# EAGLE design rpi-pwrbtn (EAGLE 6.5.0)
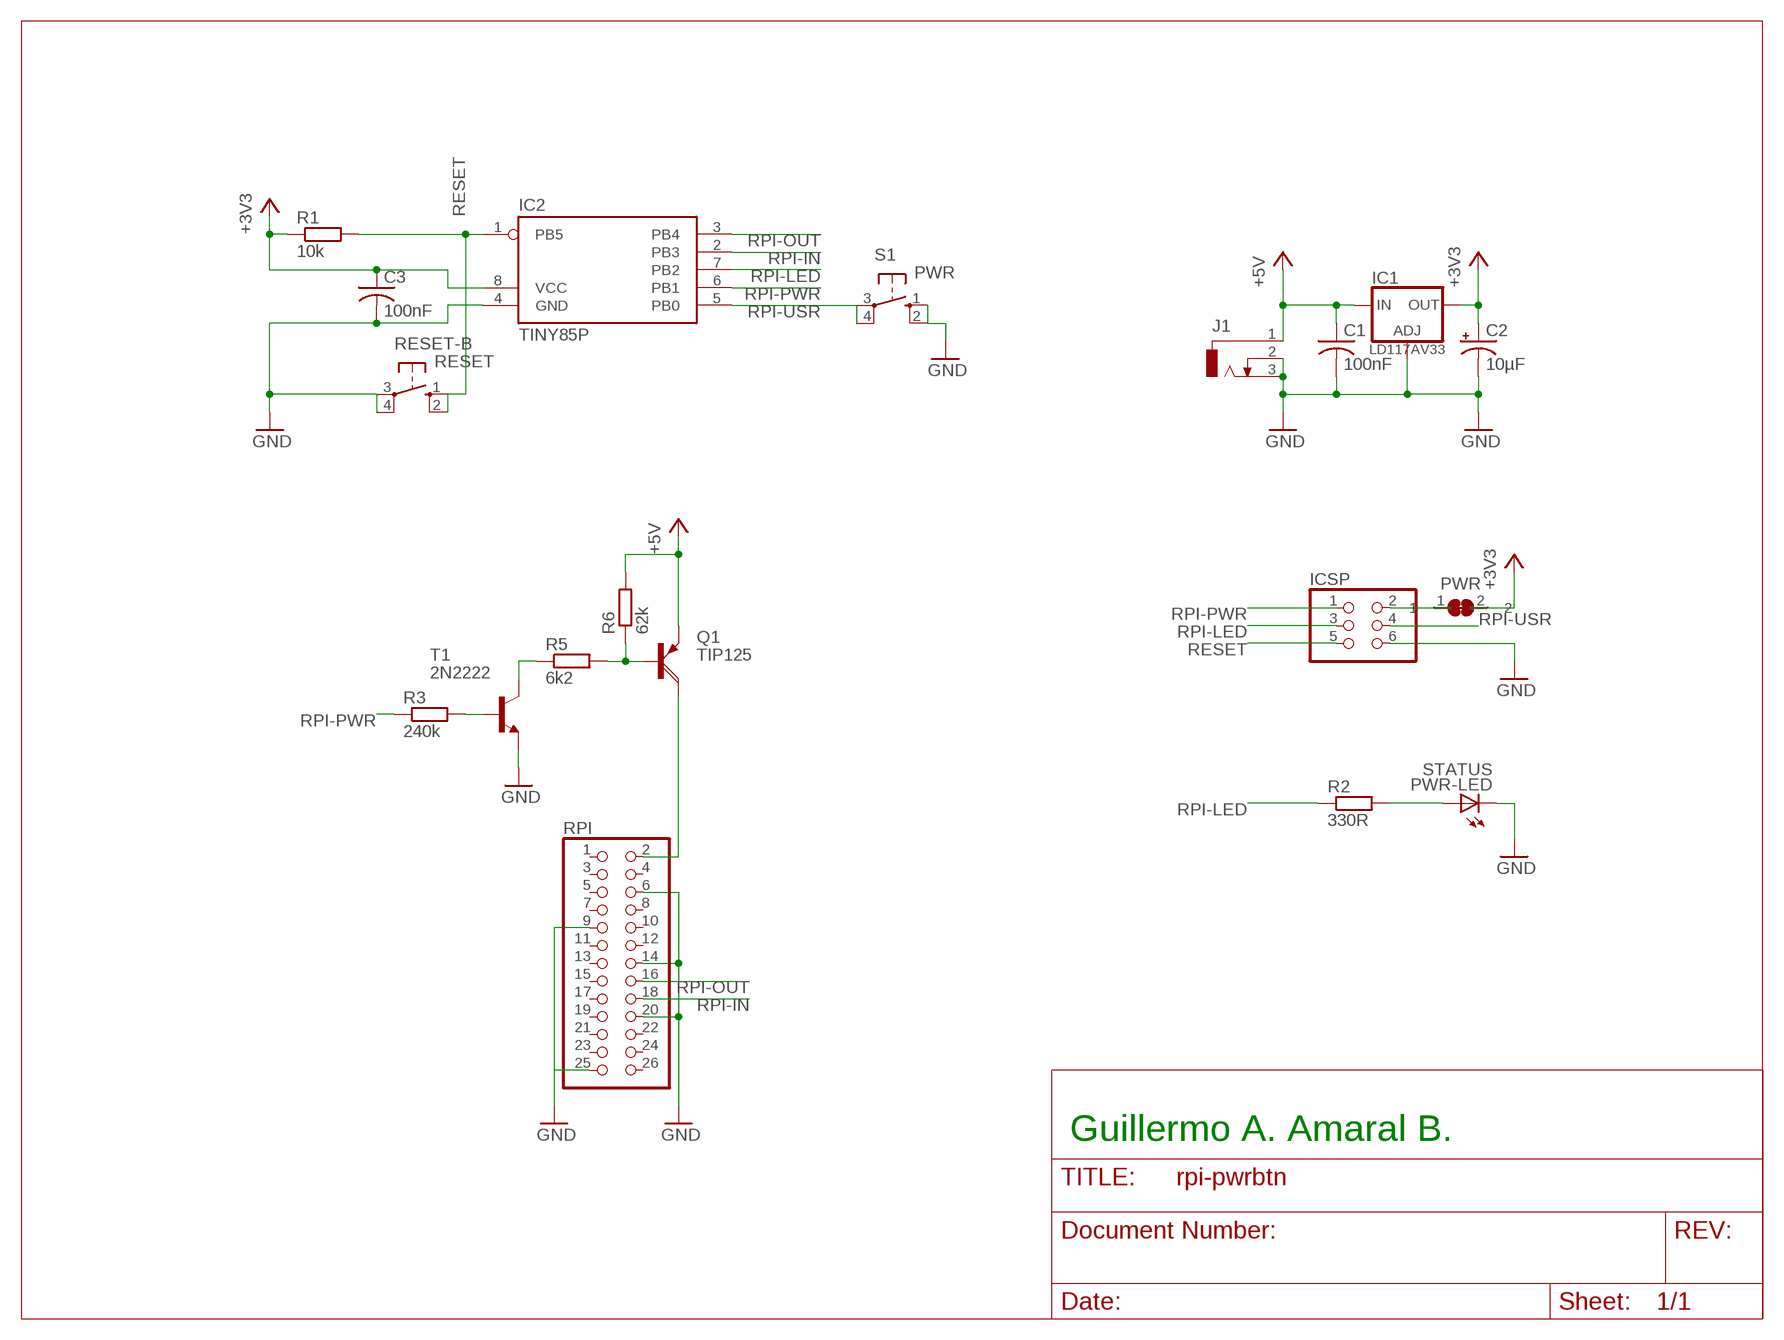
[diagram p0: schematic, sheet 1]

## Parts
C1  100nF  C-US050-024X044  [C050-024X044]
C2  10µF  CPOL-USE2,5-6E  [E2,5-6E]
C3  100nF  C-US050-024X044  [C050-024X044]
IC1  LD117AV33  [TO220L1]
IC2  TINY85P  [DIL08]
ICSP  PINHD-2X3  [2X03]
J1  DCJ0303  [DCJ0303]
PWR  SJ-BRIDGED  [SJ-BRIDGED]
PWR-LED  STATUS  LED5MM  [LED5MM]
Q1  TIP125  [TO220AH]
R1  10k  R-EU_0204/7  [0204/7]
R2  330R  R-EU_0204/7  [0204/7]
R3  240k  R-EU_0204/7  [0204/7]
R5  6k2  R-EU_0204/7  [0204/7]
R6  62k  R-EU_0204/7  [0204/7]
RESET-B  RESET  10-XX  [B3F-10XX]
RPI  PINHD-2X13  [2X13]
S1  PWR  10-XX  [B3F-10XX]
T1  2N2222  [TO18]

## Nets
+3V3: C2.+ C3.1 IC1.2(OUT) IC2.8(VCC) PWR.2 R1.1
+5V: C1.1 IC1.3(IN) J1.1 Q1.E R6.2
GND: C1.2 C2.- C3.2 IC1.1(ADJ) IC2.4(GND) ICSP.6 J1.2 J1.3 PWR-LED.K(C) RESET-B.3(P) RESET-B.4(P1) RPI.6 RPI.9 RPI.14 RPI.20 RPI.25 S1.1(S) S1.2(S1) T1.1(E)
ICSP-VCC: ICSP.2 PWR.1
N$1: PWR-LED.A R2.2
N$3: Q1.C RPI.2
N$4: Q1.B R5.2 R6.1
N$5: R3.2 T1.2(B)
N$6: R5.1 T1.3(C)
RESET: IC2.1(PB5) ICSP.5 R1.2 RESET-B.1(S) RESET-B.2(S1)
RPI-IN: IC2.2(PB3) RPI.18
RPI-LED: IC2.7(PB2) ICSP.3 R2.1
RPI-OUT: IC2.3(PB4) RPI.16
RPI-PWR: IC2.6(PB1) ICSP.1 R3.1
RPI-USR: IC2.5(PB0) ICSP.4 S1.3(P) S1.4(P1)
Unconnected: RPI.1 RPI.3 RPI.4 RPI.5 RPI.7 RPI.8 RPI.10 RPI.11 RPI.12 RPI.13 RPI.15 RPI.17 RPI.19 RPI.21 RPI.22 RPI.23 RPI.24 RPI.26

## Notes on the sheet
- Guillermo A. Amaral B.

## Library data of the parts
C1 C3 = resistor:C-US: CAPACITOR, American symbol
C2 = resistor:CPOL-US: POLARIZED CAPACITOR, American symbol
IC1 = v-reg:LD117A?*: Low drop fixed and adjustable positive voltage regulators 1 A Source: http://www.st.com/stonline/products/literature/ds/7194/ld1117axx.pdf
IC2 = gamaral:TINY85: AVR ATtiny85 MICROCONTROLLER 8K ISPF 256 bytes SRAM 512 bytes EEPROM
ICSP = pinhead:PINHD-2X3: PIN HEADER
J1 = con-jack:DCJ0303: DC POWER JACK Source: DCJ0303.pdf; OC_FARNELL: unknown; OC_NEWARK: unknown
PWR = gamaral:SJ-BRIDGED: Solder Jumper - Bridged
PWR-LED = led:LED: LED OSRAM: - CHIPLED LG R971, LG N971, LY N971, LG Q971, LY Q971, LO R971, LY R971 LH N974, LH R974 LS Q976, LO Q976, LY Q976 LO Q996 - Hyper CHIPLED LW Q18S LB Q993, LB Q99A, LB R99A - SideLED LS A670, LO A670, LY A670, LG A670, LP A670 LB A673, LV A673, LT A673, LW A673 LH A674 LY A675 LS A676, LA A676, LO A676, LY A676, LW A676 LS A679, LY A679, LG A679 - Hyper Micro SIDELED® LS Y876, LA Y876, LO Y876, LY Y876 LT Y87S - SmartLED LW L88C, LW L88S LB L89C, LB L89S, LG L890 LS L89K, LO L89K, LY L89K LS L896, LA L896, LO L896, LY L896 - TOPLED LS T670, LO T670, LY T670, LG T670, LP T670 LSG T670, LSP T670, LSY T670, LOP T670, LYG T670 LG T671, LOG T671, LSG T671 LB T673, LV T673, LT T673, LW T673 LH T674 LS T676, LA T676, LO T676, LY T676, LB T676, LH T676, LSB T676, LW T676 LB T67C, LV T67C, LT T67C, LS T67K, LO T67K, LY T67K, LW E67C LS E67B, LA E67B, LO E67B, LY E67B, LB E67C, LV E67C, LT E67C LW T67C LS T679, LY T679, LG T679 LS T770, LO T770, LY T770, LG T770, LP T770 LB T773, LV T773, LT T773, LW T773 LH T774 LS E675, LA E675, LY E675, LS T675 LS T776, LA T776, LO T776, LY T776, LB T776 LHGB T686 LT T68C, LB T68C - Hyper Mini TOPLED® LB M676 - Mini TOPLED Santana® LG M470 LS M47K, LO M47K, LY M47K Source: http://www.osram.convergy.de LUXEON: - LUMILED® LXK2-PW12-R00, LXK2-PW12-S00, LXK2-PW14-U00, LXK2-PW14-V00 LXK2-PM12-R00, LXK2-PM12-S00, LXK2-PM14-U00 LXK2-PE12-Q00, LXK2-PE12-R00, LXK2-PE12-S00, LXK2-PE14-T00, LXK2-PE14-U00 LXK2-PB12-K00, LXK2-PB12-L00, LXK2-PB12-M00, LXK2-PB14-N00, LXK2-PB14-P00, LXK2-PB14-Q00 LXK2-PR12-L00, LXK2-PR12-M00, LXK2-PR14-Q00, LXK2-PR14-R00 LXK2-PD12-Q00, LXK2-PD12-R00, LXK2-PD12-S00 LXK2-PH12-R00, LXK2-PH12-S00 LXK2-PL12-P00, LXK2-PL12-Q00, LXK2-PL12-R00 Source: www.luxeon.com KINGBRIGHT: KA-3528ASYC Source: www.kingbright.com
Q1 = transistor-power:TIP125: PNP DARLINGTON TRANSISTOR
R1-R3 R5 R6 = resistor:R-EU_: RESISTOR, European symbol
RESET-B S1 = switch-omron:10-XX: OMRON SWITCH; MPN: B3F-1000; OC_FARNELL: 176432; OC_NEWARK: 36M3542
RPI = pinhead:PINHD-2X13: PIN HEADER
T1 = transistor:2N2222: NPN TRANSISTOR

## Board
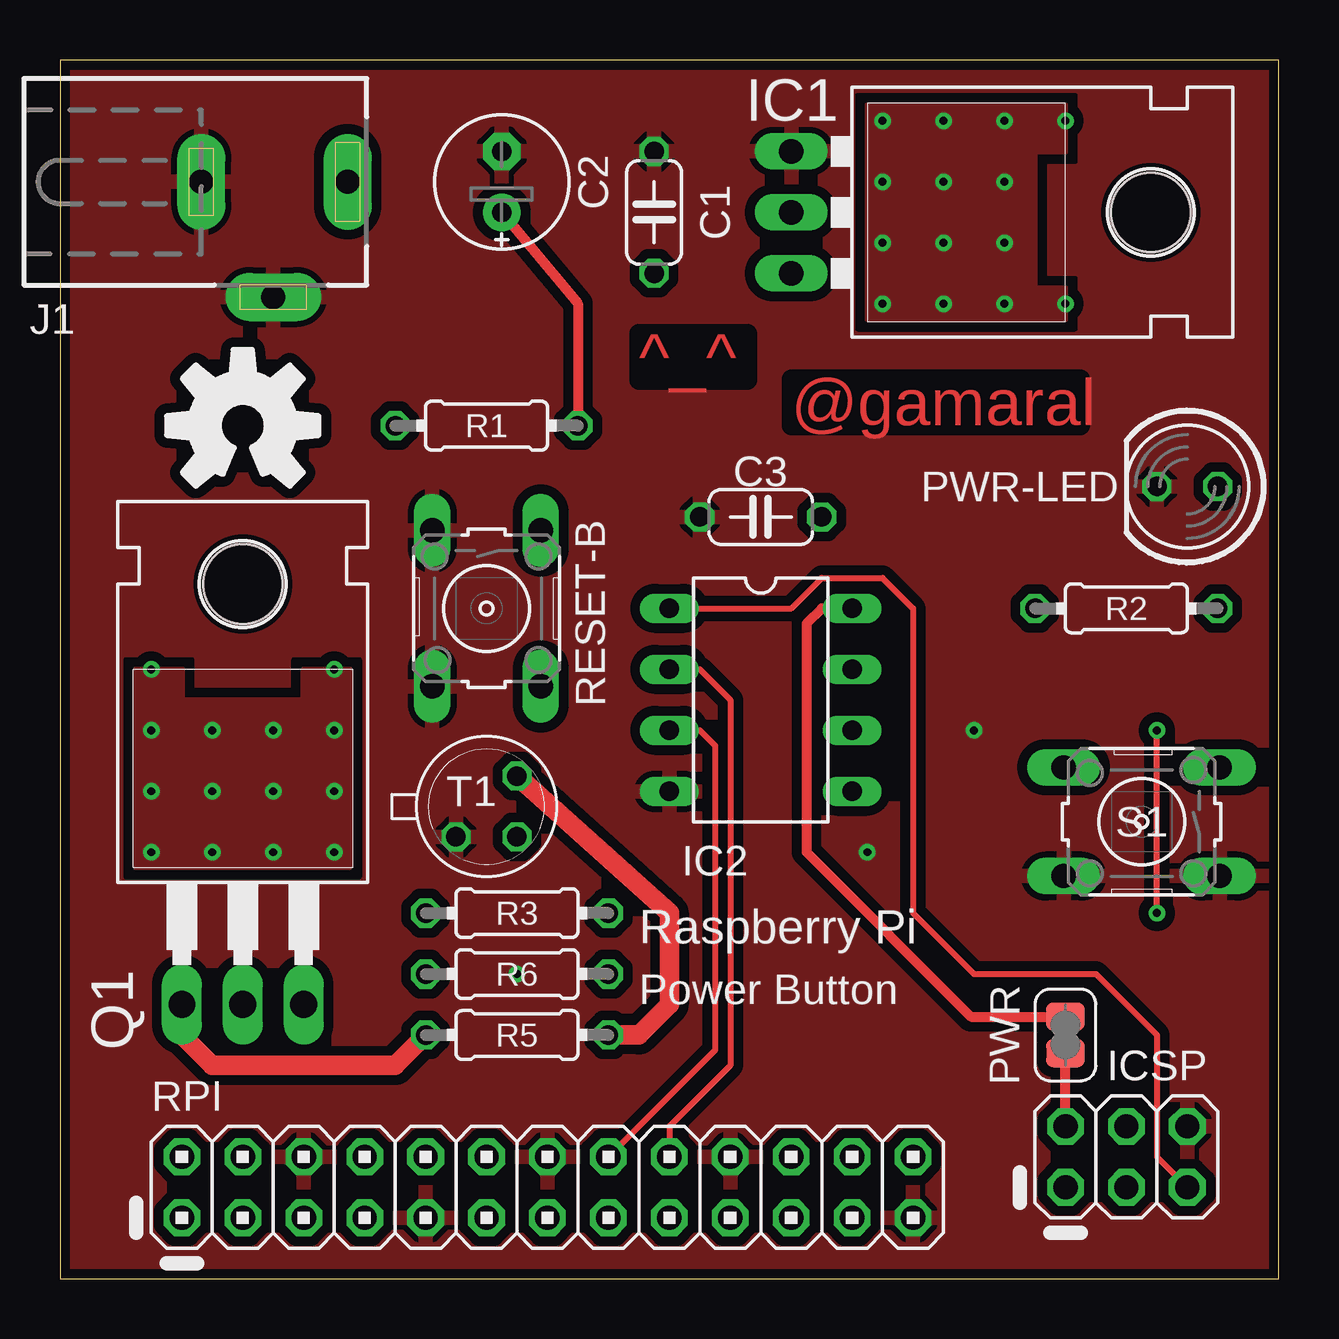
[diagram p1: board, top side]
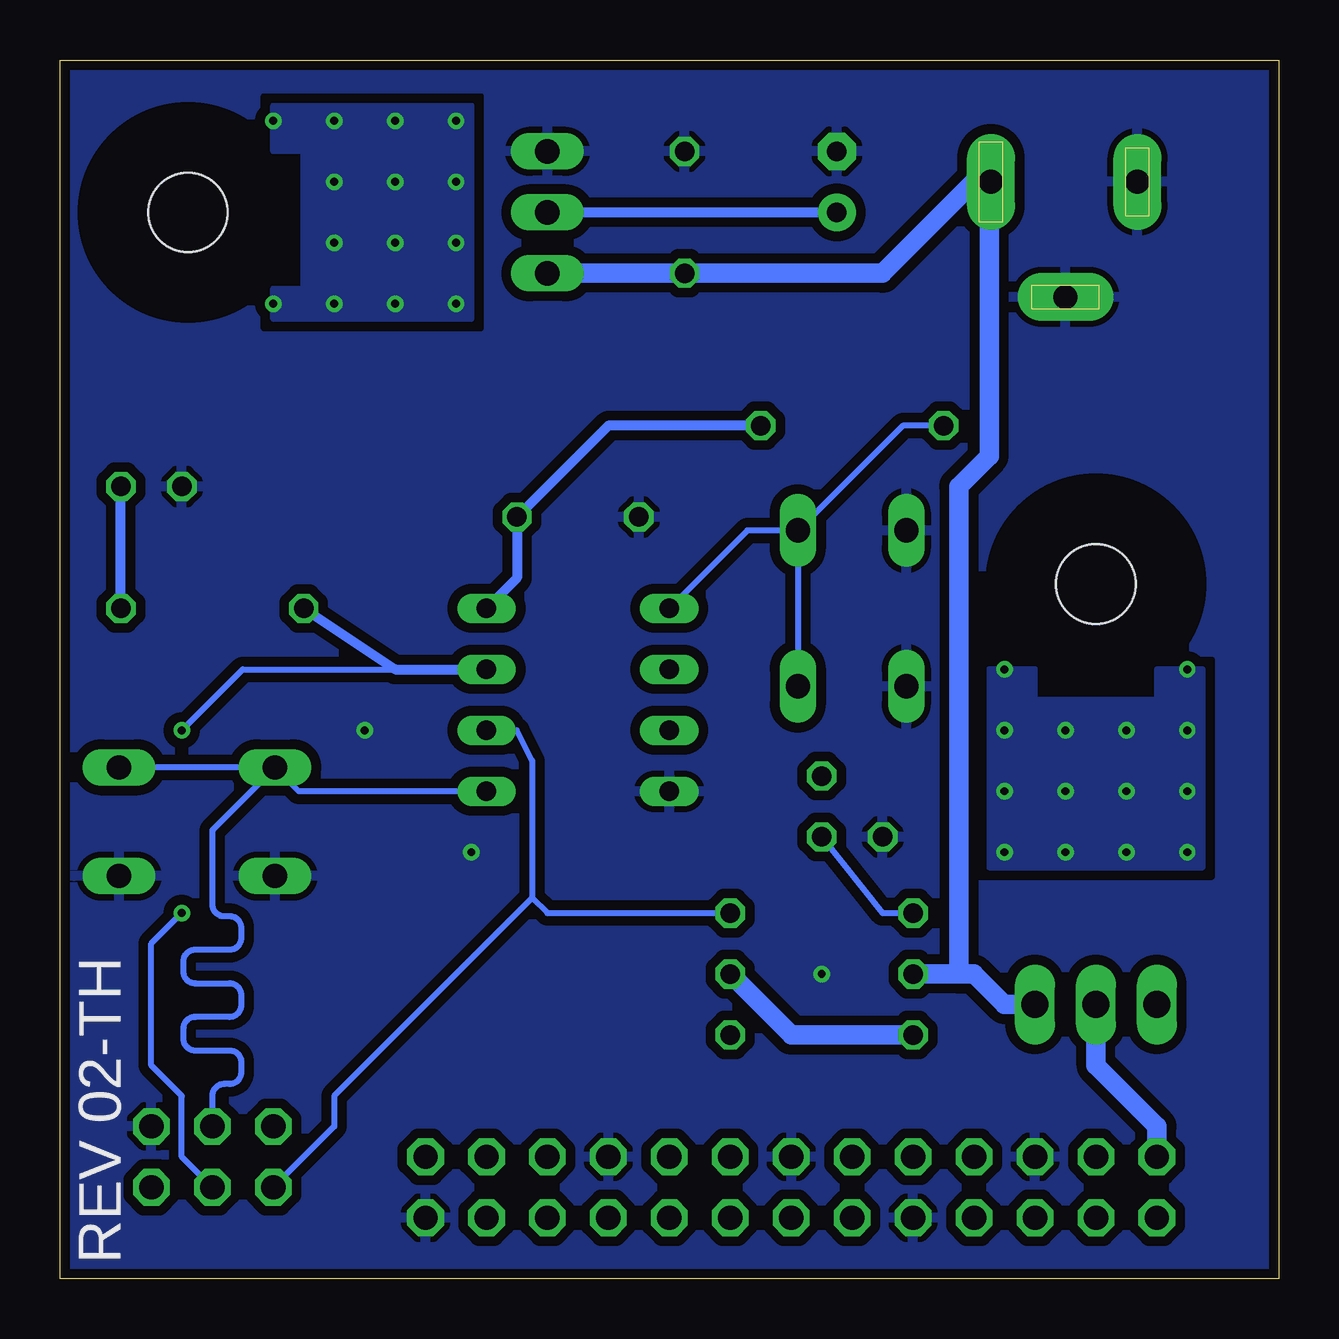
[diagram p2: board, bottom side, seen from below]

Size 50.8 x 50.8 mm. Coordinates in mm from the lower left corner, seen from the top.
Outline: 0,0 50.8,0 50.8,50.8 0,50.8 0,0
Copper layers (1*16): Top 0.0356mm / dielectric 1.5011mm / Bottom 0.0356mm
Design rules "LaenPCBOrder": minimum track width 6mil, minimum drill 13mil, track to track 6mil, track to pad 6mil, pad to pad 6mil, via to via 6mil, smd to smd 6mil, copper to edge 15mil, drill to drill 6mil, minimum pad ring 7mil, minimum via ring 7mil, stop-mask expansion 4mil, vias tented up to drill 0mil, thermal gap 10mil

### Footprints (pad centres in the part's own frame; a part is rotated, then mirrored left to right if it is on the bottom)
C050-024X044 = drill 0.813 octagon: 1 -2.54,0; 2 2.54,0
E2,5-6E = drill 0.813 pad 1.575: + -1.27,0 | drill 0.813 pad 1.575 octagon: - 1.27,0
TO220L1 = drill 1.016 long: 1 -2.54,-3.81; 2 0,-3.81; 3 2.54,-3.81 | hole 3.302: 0,11.176
DIL08 = drill 0.813 long: 1 -3.81,-3.81; 2 -1.27,-3.81; 3 1.27,-3.81; 4 3.81,-3.81; 5 3.81,3.81; 6 1.27,3.81; 7 -1.27,3.81; 8 -3.81,3.81
2X03 = drill 1.016 octagon: 1 -2.54,-1.27; 2 -2.54,1.27; 3 0,-1.27; 4 0,1.27; 5 2.54,-1.27; 6 2.54,1.27
DCJ0303 = drill 1 pad 2 long: 1 0,3.1; 2 4.8,0; 3 0,-3
SJ-BRIDGED = smd 1.168 x 1.6: 1 -0.762,0; 2 0.762,0
LED5MM = drill 0.813 octagon: A -1.27,0; K 1.27,0
TO220AH = drill 1.118 long: B -2.54,-6.35; C 0,-6.35; E 2.54,-6.35 | hole 3.302: 0,11.176
0204/7 = drill 0.813 octagon: 1 -3.81,0; 2 3.81,0
B3F-10XX = drill 1.016 long: 1 -3.251,2.261; 2 3.251,2.261; 3 -3.251,-2.261; 4 3.251,-2.261
2X13 = drill 1.016 octagon: 1 -15.24,-1.27; 2 -15.24,1.27; 3 -12.7,-1.27; 4 -12.7,1.27; 5 -10.16,-1.27; 6 -10.16,1.27; 7 -7.62,-1.27; 8 -7.62,1.27; 9 -5.08,-1.27; 10 -5.08,1.27; 11 -2.54,-1.27; 12 -2.54,1.27; 13 0,-1.27; 14 0,1.27; 15 2.54,-1.27; 16 2.54,1.27; 17 5.08,-1.27; 18 5.08,1.27; 19 7.62,-1.27; 20 7.62,1.27; 21 10.16,-1.27; 22 10.16,1.27; 23 12.7,-1.27; 24 12.7,1.27; 25 15.24,-1.27; 26 15.24,1.27
TO18 = drill 0.813 octagon: 1 -1.27,-1.27; 2 1.27,-1.27; 3 1.27,1.27

### Placement (x,y rotation side)
C1  24.77,44.45 90 top
C2  18.41,45.72 90 top
C3  29.21,31.75 180 top
IC1  34.29,44.45 270 top
IC2  29.21,24.13 270 top
ICSP  44.45,5.08 0 top
J1  8.89,45.72 270 top
PWR  41.91,10.16 90 top
PWR-LED  46.99,33.02 180 top
Q1  7.62,17.78 0 top
R1  17.78,35.56 180 top
R2  44.45,27.94 0 top
R3  19.05,15.24 180 top
R5  19.05,10.16 180 top
R6  19.05,12.7 180 top
RESET-B  17.78,27.94 270 top
RPI  20.32,3.81 0 top
S1  45.09,19.05 180 top
T1  17.78,19.68 0 top

### Tracks (layer width: path | path; a pad name or v marks a point on that pad's centre or on a via)
+3V3
  Top 0.406: C2.+ 21.59,40.64 R1.1 | IC2.8 31.75,27.94 31.11,27.3 31.11,17.78 37.97,10.92 PWR.2
  Bottom 0.406: IC1.2 C2.+ | R1.1 27.94,35.56 C3.1 31.75,29.21 IC2.8
+5V
  Bottom 0.813: IC1.3 C1.1 16.51,41.91 12.7,45.72 J1.1 12.06,44.45 12.06,34.29 13.34,33.02 13.34,12.7 | 13.34,12.7 12.7,12.7 11.43,11.43 Q1.E | 13.34,12.7 R6.2
GND  (via drill 0.33)
  other vias: 33.66,17.78 38.1,22.86 19.05,12.7
  pour Top (isolate 0.406, rank 2): 0,50.8 50.8,50.8 50.8,0 0,0
  pour Bottom (isolate 0.406, rank 2): 0,50.8 50.8,50.8 50.8,0 0,0
HS1  (via drill 0.33)
  other vias: 41.91,48.26 39.37,48.26 36.83,48.26 34.29,48.26 34.29,40.64 36.83,40.64 39.37,40.64 41.91,40.64 34.29,43.18 34.29,45.72 36.83,45.72 36.83,43.18 39.37,43.18 39.37,45.72
  pour Top (no thermals): 33.66,48.9 33.66,40.01 41.91,40.01 41.91,41.27 40.64,41.27 40.64,46.99 41.91,46.99 41.91,48.9
  pour Bottom (no thermals): 33.66,48.9 33.66,40.01 41.91,40.01 41.91,41.27 40.64,41.27 40.64,46.99 41.91,46.99 41.91,48.9
HS2  (via drill 0.33)
  other vias: 3.81,25.4 11.43,25.4 11.43,17.78 3.81,17.78 3.81,20.32 3.81,22.86 11.43,22.86 11.43,20.32 8.89,20.32 6.35,20.32 6.35,22.86 8.89,22.86 8.89,17.78 6.35,17.78
  pour Top: 3.17,25.4 5.08,25.4 5.08,24.13 10.16,24.13 10.16,25.4 12.06,25.4 12.06,17.14 3.17,17.14
  pour Bottom: 3.17,25.4 5.08,25.4 5.08,24.13 10.16,24.13 10.16,25.4 12.06,25.4 12.06,17.14 3.17,17.14
ICSP-VCC
  Top 0.406: ICSP.2 PWR.1
N$1
  Bottom 0.406: R2.2 PWR-LED.A
N$2
  Top 0.254: 8.46,33.54 arc10 8.78,33.71 9.57,33.06 10.12,33.6 9.47,34.4 arc19 9.75,35.07 10.77,35.17 10.77,35.95 9.75,36.05 arc19 9.47,36.72 10.12,37.52 9.57,38.06 8.78,37.41 arc19 8.11,37.69 8.01,38.71 7.23,38.71 7.13,37.69 arc19 6.46,37.41 5.67,38.06 5.12,37.52 5.77,36.72 arc19 5.49,36.05 4.47,35.95 4.47,35.17 5.49,35.07 arc19 5.77,34.4 5.12,33.6 5.67,33.06 6.46,33.71 arc10 6.79,33.54 7.24,34.64 arc-68 6.63,35.56 arc-248 8,34.64 8.46,33.54
N$3
  Bottom 0.813: RPI.2 5.08,6.35 7.62,8.89 Q1.C
N$4
  Top 0.813: Q1.B 5.08,10.16 6.35,8.89 13.97,8.89 R5.2
  Bottom 0.813: R6.1 20.32,10.16 R5.2
N$5
  Bottom 0.254: T1.2 16.51,15.24 R3.2
N$6
  Top 0.813: T1.3 25.4,15.24 25.4,11.43 24.13,10.16 R5.1
RESET
  Top 0.254: IC2.1 30.48,27.94 31.75,29.21 34.29,29.21 35.56,27.94 35.56,15.24 38.1,12.7 43.18,12.7 45.72,10.16 45.72,5.08 ICSP.5
  Bottom 0.254: R1.2 15.67,35.56 RESET-B.1 | RESET-B.1 RESET-B.2 | RESET-B.1 22.15,31.19 IC2.1
RPI-IN
  Top 0.254: RPI.18 25.4,6.35 27.94,8.89 27.94,24.13 26.67,25.4 IC2.2
RPI-LED  (via drill 0.33)
  Top 0.254: v45.72,15.24 v45.72,22.86
  Bottom 0.254: ICSP.3 45.72,5.08 45.72,7.62 46.99,8.89 46.99,13.97 v45.72,15.24 | v45.72,22.86 43.18,25.4 36.83,25.4
  Bottom 0.406: R2.1 36.83,25.4 IC2.7
RPI-OUT
  Top 0.254: IC2.3 26.67,22.86 27.3,22.23 27.3,9.53 RPI.16
RPI-PWR
  Bottom 0.254: 31.11,15.88 31.11,21.59 31.75,22.86 IC2.6 | 31.11,15.88 39.37,7.62 39.37,6.35 ICSP.1 | 31.11,15.88 30.48,15.24 R3.1
RPI-USR
  Bottom 0.254: IC2.5 40.84,20.32 S1.4 | S1.4 S1.3 | S1.4 44.45,18.69 44.45,15.61 arc-90 43.95,15.11 43.74,15.11 arc90 43.24,14.62 43.24,14.21 arc90 43.74,13.71 45.16,13.71 arc-90 45.66,13.22 45.66,12.81 arc-90 45.16,12.31 43.74,12.31 arc90 43.24,11.82 43.24,11.41 arc90 43.74,10.91 45.16,10.91 arc-90 45.66,10.42 45.66,10.01 arc-90 45.16,9.52 43.74,9.52 arc90 43.24,9.02 43.24,8.61 arc90 43.74,8.12 43.95,8.12 arc-90 44.45,7.62 ICSP.4

### Text on the board
Top: ^_^ | @gamaral
tNames: Raspberry Pi | Power Button
bNames: REV 02-TH